# Altium project Guide_Project.PrjPcb
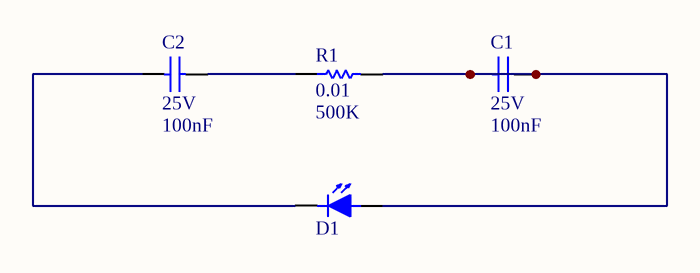
[diagram p0: Sheet3.SchDoc]
1 sheet, 4 parts. Net scope: global (net labels, ports and power ports of the same name join across sheets).

## Sheet Sheet3.SchDoc
size A4

### Parts
C1  value 100nF  Voltage Rating: 25V  [Cap 0603 (1608 Metric)]  (hidden comment: Cap 0603 (1608 Metric))
C2  value 100nF  Voltage Rating: 25V  [Cap 0603 (1608 Metric)]  (hidden comment: Cap 0603 (1608 Metric))
D1  0805 (2.0mmx1.25mm)  [D0805]  (value not drawn)
R1  value 500K  Tolerance: 0.01  [Res 0603 (1608 Metric)]  (hidden comment: Res 0603 (1608 Metric))

### Nets
NetC1_1: C1.1 C1.2 D1.A R1.2
NetC2_1: C2.1 D1.C
NetC2_2: C2.2 R1.1

### Library data of the parts
C1 C2 = C4: 0603 (1608 Metric) 4-200V SMD Capacitor; Manufacturer: Various; Dielectric: X5R / X7R; Manufacturer Part Number: Various; Part Number (Farnell): 1759037; Part Number (Mouser): n/a; Part Number (Digi-Key): n/a; Type: Capacitor; Part ID: C4
D1 = D600: KP-2012, KPT-2012, KPHCM-2012 Series; Manufacturer: Kingbright; Manufacturer Part Number: KP-2012QBC-D; Colour: Blue; Forward Voltage: 3.3V; Type: LED; Package: 0805; Pin Count: 2; Part Number (Farnell): *; Part Number (Digi-Key): *; Part Number (Mouser): *; Part Number (RS): *; Value: *; Part ID: D600
R1 = R900: 0603 (1608 Metric) 0.1W SMD Resistor; Manufacturer Part Number: Various; Power Rating: 63mW+; Voltage Rating: 50V+; Footprint: 0603; Type: Resistor; Part Number (Mouser): n/a; Part Number (Farnell): 9331263; Part Number (Digi-Key): n/a; Manufacturer: Various; Part ID: R900